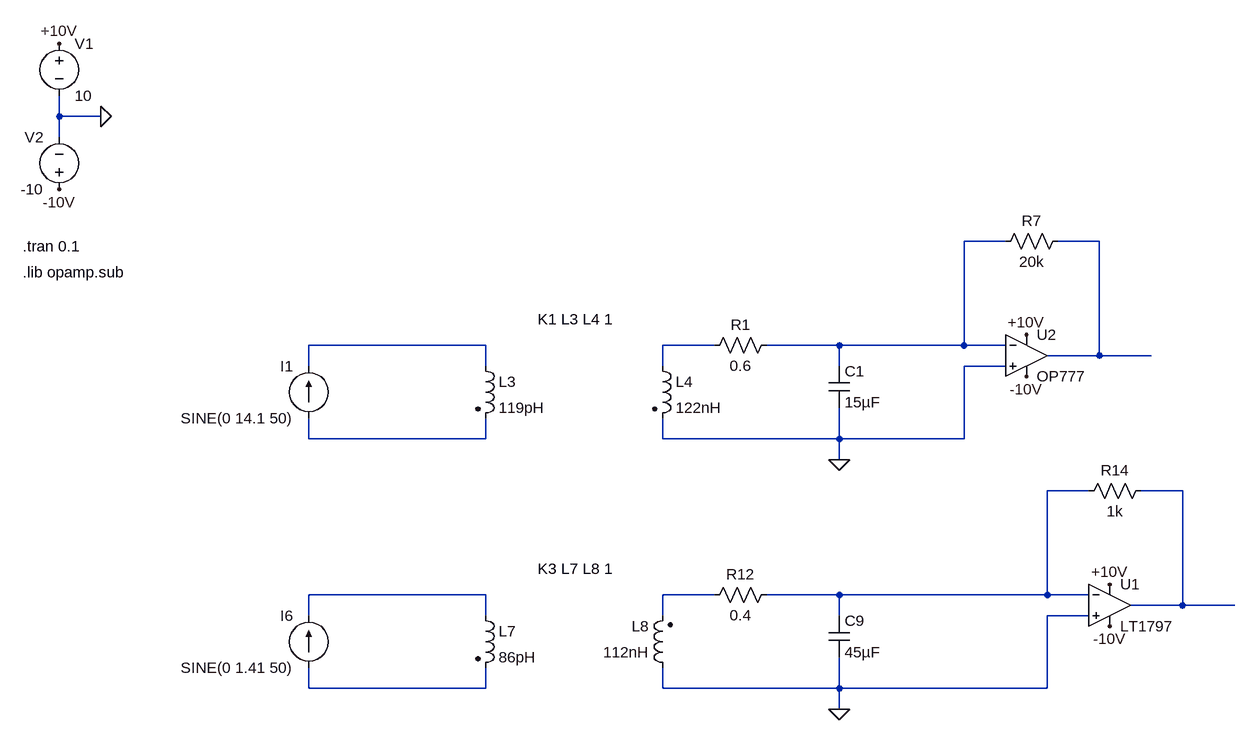
[diagram p0: schematic Rogowski coil.asc]
Rogowski coil.asc, the LTspice schematic file:
Version 4
SHEET 1 4008 1728
WIRE 176 192 176 160
WIRE 240 192 176 192
WIRE 176 224 176 192
WIRE 1632 384 1568 384
WIRE 1776 384 1712 384
WIRE 832 544 560 544
WIRE 1184 544 1104 544
WIRE 1376 544 1264 544
WIRE 1568 544 1568 384
WIRE 1568 544 1376 544
WIRE 1632 544 1568 544
WIRE 1776 560 1776 384
WIRE 1776 560 1696 560
WIRE 1856 560 1776 560
WIRE 560 576 560 544
WIRE 832 576 832 544
WIRE 1104 576 1104 544
WIRE 1376 576 1376 544
WIRE 1632 576 1568 576
WIRE 560 688 560 656
WIRE 832 688 832 656
WIRE 832 688 560 688
WIRE 1104 688 1104 656
WIRE 1376 688 1376 640
WIRE 1376 688 1104 688
WIRE 1568 688 1568 576
WIRE 1568 688 1376 688
WIRE 1376 720 1376 688
WIRE 1760 768 1696 768
WIRE 1904 768 1840 768
WIRE 832 928 560 928
WIRE 1184 928 1104 928
WIRE 1376 928 1264 928
WIRE 1696 928 1696 768
WIRE 1696 928 1376 928
WIRE 1760 928 1696 928
WIRE 1904 944 1904 768
WIRE 1904 944 1824 944
WIRE 1984 944 1904 944
WIRE 560 960 560 928
WIRE 832 960 832 928
WIRE 1104 960 1104 928
WIRE 1376 960 1376 928
WIRE 1760 960 1696 960
WIRE 560 1072 560 1040
WIRE 832 1072 832 1040
WIRE 832 1072 560 1072
WIRE 1104 1072 1104 1040
WIRE 1376 1072 1376 1024
WIRE 1376 1072 1104 1072
WIRE 1696 1072 1696 960
WIRE 1696 1072 1376 1072
WIRE 1376 1104 1376 1072
FLAG 240 192 0
FLAG 176 80 +10V
FLAG 176 304 -10V
FLAG 1376 720 0
FLAG 1664 528 +10V
FLAG 1664 592 -10V
FLAG 1376 1104 0
FLAG 1792 912 +10V
FLAG 1792 976 -10V
SYMBOL voltage 176 64 R0
WINDOW 123 0 0 Left 0
WINDOW 39 0 0 Left 0
SYMATTR InstName V1
SYMATTR Value 10
SYMBOL voltage 176 320 R180
WINDOW 0 24 96 Left 2
WINDOW 3 24 16 Left 2
WINDOW 123 0 0 Left 0
WINDOW 39 0 0 Left 0
SYMATTR InstName V2
SYMATTR Value -10
SYMBOL ind2 816 560 R0
SYMATTR InstName L3
SYMATTR Value 119pH
SYMATTR Type ind
SYMBOL ind2 1088 560 R0
SYMATTR InstName L4
SYMATTR Value 122nH
SYMATTR Type ind
SYMBOL current 560 656 R180
WINDOW 0 24 80 Left 2
WINDOW 3 24 0 Left 2
WINDOW 123 0 0 Left 0
WINDOW 39 0 0 Left 0
SYMATTR InstName I1
SYMATTR Value SINE(0 14.1 50)
SYMBOL res 1280 528 R90
WINDOW 0 0 56 VBottom 2
WINDOW 3 32 56 VTop 2
SYMATTR InstName R1
SYMATTR Value 0.6
SYMBOL res 1728 368 R90
WINDOW 0 0 56 VBottom 2
WINDOW 3 32 56 VTop 2
SYMATTR InstName R7
SYMATTR Value 20k
SYMBOL ind2 816 944 R0
SYMATTR InstName L7
SYMATTR Value 86pH
SYMATTR Type ind
SYMBOL ind2 1120 1056 R180
WINDOW 0 36 80 Left 2
WINDOW 3 36 40 Left 2
SYMATTR InstName L8
SYMATTR Value 112nH
SYMATTR Type ind
SYMBOL current 560 1040 R180
WINDOW 0 24 80 Left 2
WINDOW 3 24 0 Left 2
WINDOW 123 0 0 Left 0
WINDOW 39 0 0 Left 0
SYMATTR InstName I6
SYMATTR Value SINE(0 1.41 50)
SYMBOL res 1280 912 R90
WINDOW 0 0 56 VBottom 2
WINDOW 3 32 56 VTop 2
SYMATTR InstName R12
SYMATTR Value 0.4
SYMBOL cap 1360 960 R0
SYMATTR InstName C9
SYMATTR Value 45µF
SYMBOL res 1856 752 R90
WINDOW 0 0 56 VBottom 2
WINDOW 3 32 56 VTop 2
SYMATTR InstName R14
SYMATTR Value 1k
SYMBOL Opamps\\LT1797 1792 880 R0
SYMATTR InstName U1
SYMBOL Opamps\\OP777 1664 496 R0
SYMATTR InstName U2
SYMBOL cap 1360 576 R0
SYMATTR InstName C1
SYMATTR Value 15µF
TEXT 120 392 Left 2 !.tran 0.1
TEXT 912 504 Left 2 !K1 L3 L4 1
TEXT 912 888 Left 2 !K3 L7 L8 1
TEXT 120 432 Left 2 !.lib opamp.sub

The netlist it stands for:
* Rogowski coil.asc
V1 +10V 0 10
V2 -10V 0 -10
L3 N003 N005 119pH
L4 N004 0 122nH
I1 N005 N003 SINE(0 14.1 50)
R1 N001 N004 0.6
R7 N002 N001 20k
L7 N008 N010 86pH
L8 0 N009 112nH
I6 N010 N008 SINE(0 1.41 50)
R12 N006 N009 0.4
C9 N006 0 45µF
R14 N007 N006 1k
XU1 0 N006 +10V -10V N007 LT1797  ; pins In+ In- V+ V- OUT
XU2 0 N001 +10V -10V N002 OP777  ; pins In+ In- V+ V- OUT
C1 N001 0 15µF
.tran 0.1
K1 L3 L4 1
K3 L7 L8 1
.lib opamp.sub
.lib ADI.lib
.backanno
.end